# Altium schematic sheet CATS-FAT-CAN.SchDoc: CATS Pro
size A4; Author: Luca Jost; Revision: 1.0; SheetNumber: 7; SheetTotal: 13; Subtitle: CAN Bus
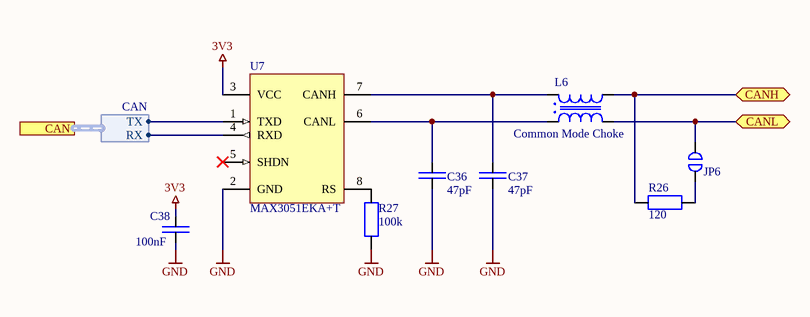
[diagram p0: CATS-FAT-CAN.SchDoc]

## Parts
C36  47pF  [SMD Keramikkondensator 0603]
C37  47pF  [SMD Keramikkondensator 0603]
C38  100nF  [SMD Keramikkondensator 0603]
JP6  Jumper  [SMD Solder Jumper 1x2mm]  (value not drawn)  (no BOM)
L6  Common Mode Choke  [SMD Common Mode Choke 2x1.2]
R26  120  [SMD Widerstand 0603]
R27  100k  [SMD Widerstand 0603]
U7  MAX3051EKA+T  [SMD IC SOT-23-8]

## Ports
CAN (harness CAN), CANH (bidir), CANL (bidir)

## Harnesses
CAN: TX, RX

## Nets
3V3: C38.2 U7.3(VCC)
GND: C36.1 C37.1 C38.1 R27.1 U7.2(GND)
CANH: L6.2 R26.1 ; port CANH
CANL: JP6.1 L6.3 ; port CANL
NetC36_2: C36.2 L6.4 U7.6(CANL)
NetC37_2: C37.2 L6.1 U7.7(CANH)
NetJP6_2: JP6.2 R26.2
NetR27_2: R27.2 U7.8(RS)
NetU7_1: U7.1(TXD) ; port CAN.TX
NetU7_4: U7.4(RXD) ; port CAN.RX

Not connected (* = marked no-connect by the designer): U7 5(SHDN)*

## Notes on the sheet
- Title
- Author:
- Subtitle
- Date:
- Rev:
- CATS
- Sheet
- of
- File:

## Library data of the parts
C36 C37 = E6 - 47pF: SMD Ceramic Capacitor E6; Unit Price: 0.01; Number: -; Supplier: -
C38 = E6 - 100nF: SMD Ceramic Capacitor E6; Unit Price: 0.01; Number: -; Supplier: -
JP6 = Jumper-1: Single Position Jumper
L6 = Common Mode Choke (CAN): 2 Line Common Mode Choke Surface Mount 370mA DCR 300mOhm; ComponentLink1Description: Datasheet; ComponentLink1URL: https://www.we-online.de/katalog/datasheet/744231121.pdf; Digikey: 732-1465-2-ND
R26 = E24 - 120: SMD Chip Resistor E24; Unit Price: 0.01; Number: -; Supplier: -
R27 = E24 - 100k: SMD Chip Resistor E24; Unit Price: 0.01; Number: -; Supplier: -
U7 = MAX3051EKA+T: +3.3V, 1Mbps, Low-Supply-Current / CAN Transceiver; ComponentLink1Description: Datasheet; ComponentLink1URL: https://datasheets.maximintegrated.com/en/ds/MAX3051.pdf; Digikey: MAX3051EKA+TTR-ND